# EAGLE design buck converter (EAGLE 6.6.0)
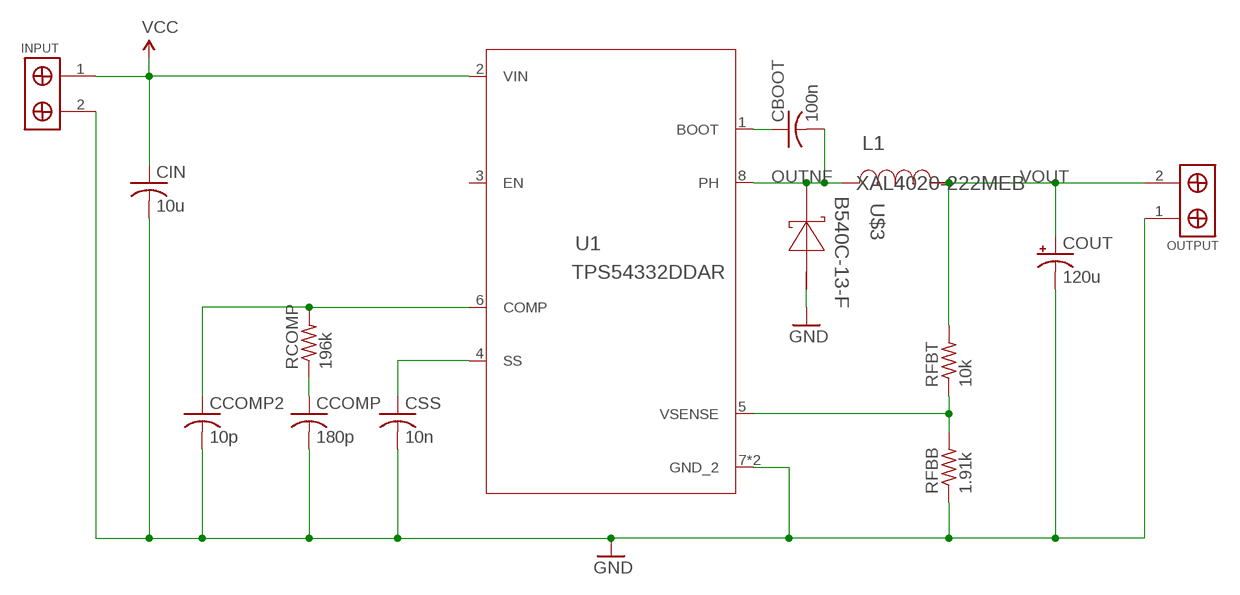
[diagram p0: schematic, sheet 1]

## Parts
CBOOT  100n  C-USC0805  [C0805]
CCOMP  180p  C-USC0805  [C0805]
CCOMP2  10p  C-USC0805  [C0805]
CIN  10u  C-USC1210  [C1210]
COUT  120u  CPOL-USD/7343-31R  [D/7343-31R]
CSS  10n  C-USC0805  [C0805]
INPUT  SCREW_TERMINALS  [1X02-5MM]
L1  XAL4020-222MEB  [XAL4020]
OUTPUT  SCREW_TERMINALS  [1X02-5MM]
RCOMP  196k  R-US_R0805  [R0805]
RFBB  1.91k  R-US_R0805  [R0805]
RFBT  10k  R-US_R0805  [R0805]
U1  TPS54332DDAR  [DDA0008H]
U$3  B540C-13-F  [SMC]

## Nets
GND: CCOMP2.2 CCOMP.2 CIN.2 COUT.- CSS.2 INPUT.2 OUTPUT.1 RFBB.1 U1.7(GND_2) U1.9(GND_2) U$3.2(A)
N$1: CCOMP.1 RCOMP.1
N$2: CCOMP2.1 RCOMP.2 U1.6(COMP)
N$3: CSS.1 U1.4(SS)
N$4: RFBB.2 RFBT.1 U1.5(VSENSE)
N$7: CBOOT.1 U1.1(BOOT)
OUTNF: CBOOT.2 L1.1 U1.8(PH) U$3.1(K)
VCC: CIN.1 INPUT.1 U1.2(VIN)
VOUT: COUT.+ L1.2 OUTPUT.2 RFBT.2
Unconnected: U1.3(EN)

## Library data of the parts
CBOOT CCOMP CCOMP2 CIN CSS = rcl:C-US: CAPACITOR, American symbol
COUT = rcl:CPOL-US: POLARIZED CAPACITOR, American symbol
INPUT OUTPUT = MarcEagleParts:SCREW_TERMINALS
L1 = TPS54332_Ti:XAL4020-222MEB; DCR: 0.04; IDC: 5.5; L: 2.2E-6; MANUFACTURER_NAME: Coilcraft; MANUFACTURER_PART_NUMBER: XAL4020-222MEB; VENDOR: Coilcraft
RCOMP RFBB RFBT = rcl:R-US_: RESISTOR, American symbol
U1 = TPS54332_Ti:TPS54332DDAR; DATASHEETURL: http://www.ti.com/product/tps54332; FREQUENCY: 1000000.0; IMAX: 3.5; MANUFACTURER_NAME: Texas Instruments; MANUFACTURER_PART_NUMBER: TPS54332DDAR; MKTG_PACKAGE: DDA0008H; NSID: TPS54332DDAR; PACKAGE: DDA0008H; VENDOR: Texas Instruments
U$3 = TPS54332_Ti:B540C-13-F; DATASHEETURL: http://www.diodes.com/datasheets/ds13012.pdf; IO: 5.0; MANUFACTURER_NAME: Diodes Inc.; MANUFACTURER_PART_NUMBER: B540C-13-F; VENDOR: Diodes Inc.; VFATIO: 0.55; VRRM: 40.0

## Board
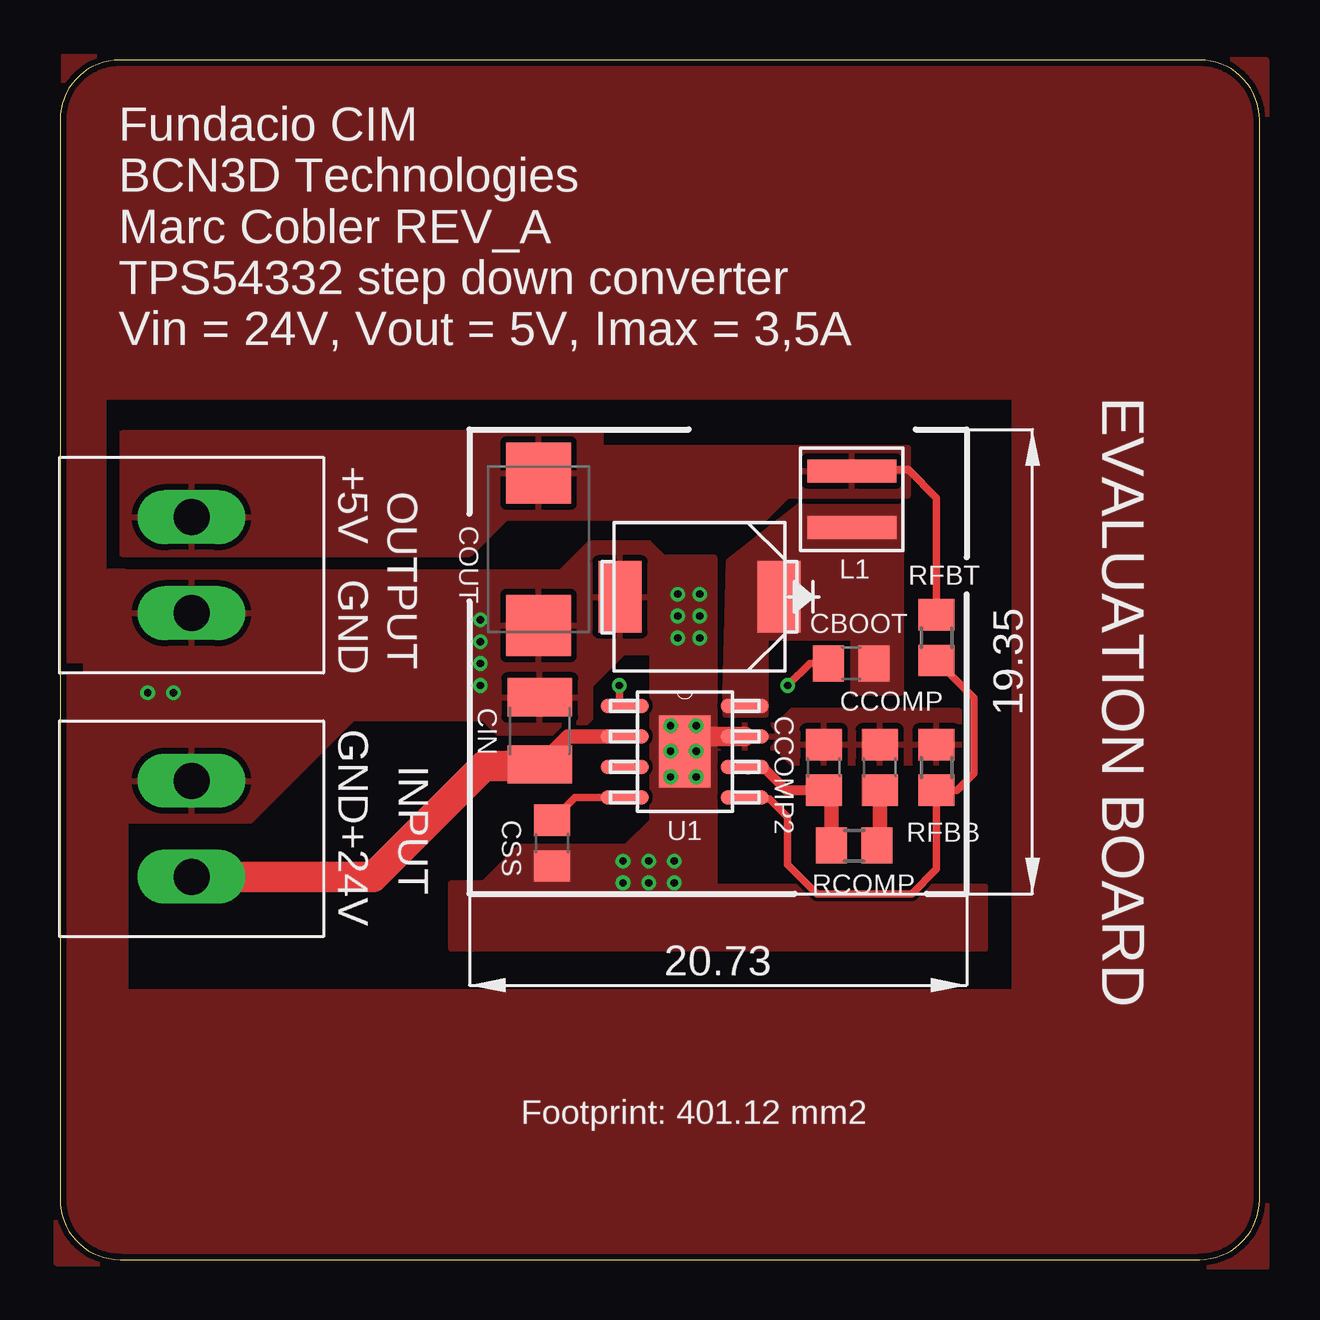
[diagram p1: board, top side]
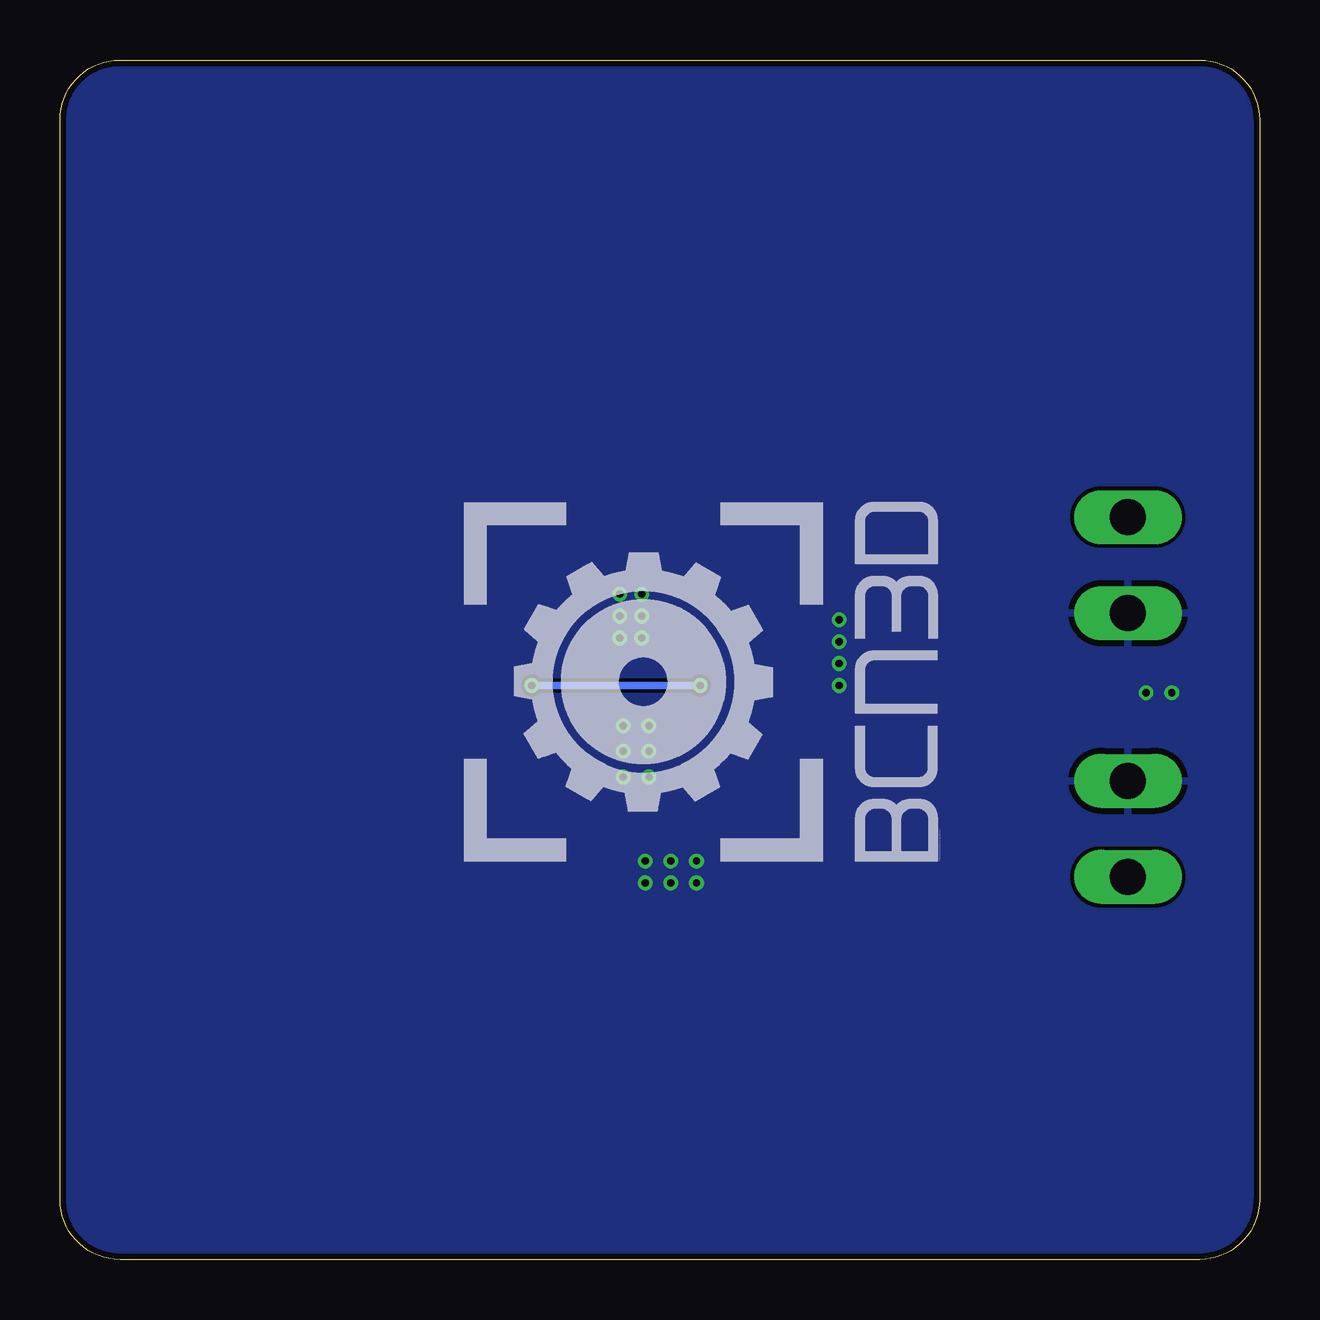
[diagram p2: board, bottom side, seen from below]

Size 50 x 50 mm. Coordinates in mm from the lower left corner, seen from the top.
Outline: 0,47.5 0,2.5 arc90 2.5,0 47.5,0 arc90 50,2.5 50,47.5 arc90 47.5,50 2.5,50 arc90 0,47.5
Copper layers (1*16): Top 0.035mm / dielectric 1.5mm / Bottom 0.035mm
Design rules "ITEADstudio_DRC": minimum track width 6mil, minimum drill 12mil, track to track 6mil, track to pad 6mil, pad to pad 6mil, via to via 6mil, smd to smd 0mil, copper to edge 10mil, drill to drill 10mil, minimum pad ring 10mil, minimum via ring 6mil, stop-mask expansion 2mil, vias tented up to drill 100mil, thermal gap 10mil

### Footprints (pad centres in the part's own frame; a part is rotated, then mirrored left to right if it is on the bottom)
C0805 = smd 1.3 x 1.5: 1 -0.95,0; 2 0.95,0
C1210 = smd 1.6 x 2.7: 1 -1.4,0; 2 1.4,0
D/7343-31R = smd 2.55 x 2.7: + 3.175,0; - -3.175,0
1X02-5MM = drill 1.5 long: 1 0,0; 2 4,0
XAL4020 = smd 0.965 x 3.708: 1 -1.181,0; 2 1.181,0
R0805 = smd 1.3 x 1.5: 1 -0.95,0; 2 0.95,0
DDA0008H = smd 2.007 x 0.61: 1 -2.5,1.905; 2 -2.5,0.635; 3 -2.5,-0.635; 4 -2.5,-1.905; 5 2.5,-1.905; 6 2.5,-0.635; 7 2.5,0.635; 8 2.5,1.905 | smd 2.134 x 2.997: 9 0,0
SMC = smd 1.803 x 2.972: 1 -3.315,0; 2 3.315,0

### Placement (x,y rotation side)
CBOOT  32.98,24.85 0 top
CCOMP  34.17,20.51 90 top
CCOMP2  31.84,20.51 90 top
CIN  20,22.03 90 top
COUT  19.95,29.6 90 top
CSS  20.51,17.36 270 top
INPUT  5.49,15.95 90 top
L1  33,31.69 90 top
OUTPUT  5.49,26.95 90 top
RCOMP  33.11,17.26 180 top
RFBB  36.54,20.51 270 top
RFBT  36.54,25.92 90 top
U1  26.04,21.17 0 top
U$1  [BCN3D_LOGO]  13.41,16.61 90 bottom
U$3  26.65,27.62 180 top

### Tracks (layer width: path | path; a pad name or v marks a point on that pad's centre or on a via)
GND  (via drill 0.3)
  Top 0.813: U1.7 26.04,21.8 U1.9
  other vias: 25.45,22.25 26.52,22.25 25.45,21.18 26.52,21.18 26.52,20.12 25.45,20.12 23.47,16.61 24.54,16.61 25.6,16.61 23.47,15.7 24.54,15.7 25.6,15.7 25.76,27.74 25.76,26.82 25.76,25.91 26.67,27.74 26.67,26.82 26.67,25.91 17.53,23.93 17.53,24.84 17.53,25.76 17.53,26.67 3.66,23.62 4.72,23.62
  pour Bottom: -1,51 -1,-1 50.09,-1.15 50.09,50.85
  pour Top: 37.49,22.86 30.48,22.86 29.87,22.25 25.91,22.25 25.91,21.34 29.87,21.34 30.48,20.73 37.49,20.73
  pour Top: 2.59,28.65 20.88,28.65 22.1,29.87 24.54,29.87 25.3,29.11 25.3,26.06 24.54,25.3 23.47,25.3 22.1,23.93 22.1,22.56 21.49,21.95 18.29,21.95 17.68,22.56 12.19,22.56 7.92,18.29 2.59,18.29
  pour Top (no thermals): 16.31,15.7 17.68,15.7 19.2,17.22 23.62,17.22 24.69,18.29 24.69,29.26 27.28,29.26 27.28,15.54 38.56,15.54 38.56,12.95 16.31,12.95
  pour Top: 1.83,28.65 1.83,35.97 39.78,35.97 39.78,11.13 2.74,11.13 2.74,24.38 -0.15,24.38 -0.15,-0.15 50.29,-0.3 50.29,49.99 0.15,50.14 0.15,24.99 2.74,24.99 2.74,28.65
  pour Top (rank 6): 1.07,25.45 1.07,22.1 5.64,22.1 5.64,25.45
N$1
  Top 0.61: CCOMP.1 34.17,17.38 RCOMP.1
N$2
  Top 0.406: CCOMP2.1 30.27,19.56 29.41,20.42 28.66,20.42 U1.6
  Top 0.61: RCOMP.2 32.16,19.24 CCOMP2.1
N$3
  Top 0.305: U1.4 21.46,19.27 CSS.1
N$4
  Top 0.305: U1.5 28.61,19.2 29.57,19.2 30.33,18.44 30.33,16.46 31.55,15.24 35.51,15.24 36.54,16.27 RFBB.2 37.39,19.56 38.1,20.27 38.1,23.41 RFBT.1
N$7  (via drill 0.3)
  Top 0.305: CBOOT.1 31.25,24.85 v30.33,23.93 | v23.32,23.93 23.32,23.3 U1.1
  Bottom 0.305: v30.33,23.93 v23.32,23.93
OUTNF
  pour Top (no thermals): 27.74,22.71 27.74,23.62 27.89,29.11 30.78,31.39 35.05,31.39 35.05,23.62 33.07,23.62 33.07,25.91 29.41,25.91 29.41,22.71
VCC
  Top 0.61: U1.2 21.17,21.8 CIN.1
  Top 1.27: INPUT.1 13.06,15.95 17.68,20.57 19.94,20.57 CIN.1
VOUT
  Top 0.305: RFBT.2 36.54,31.73 35.36,32.92 33.05,32.92 L1.2
  pour Top: 2.59,29.41 17.07,29.41 18.59,30.94 29.41,30.94 30.33,31.85 35.36,31.85 35.36,33.83 22.56,33.83 22.56,34.44 2.59,34.44

### Text on the board
tPlace: Fundacio CIM / BCN3D Technologies / Marc Cobler REV_A / TPS54332 step down converter / Vin = 24V, Vout = 5V, Imax = 3,5A | EVALUATION BOARD | +5V | GND | GND | +24V | Footprint: 401.12 mm2